# EAGLE design dice (EAGLE 9.6.2)
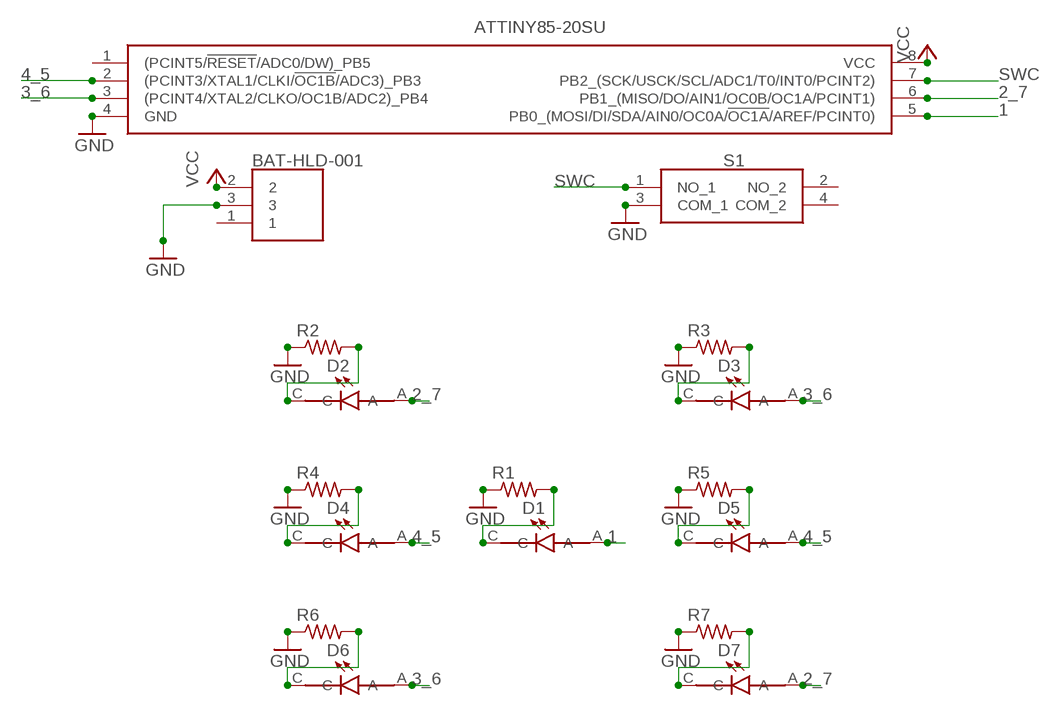
[diagram p0: schematic, sheet 1]

## Parts
D1  SML-LXT0805IW-TR  [LEDC2012X120N]
D2  SML-LXT0805IW-TR  [LEDC2012X120N]
D3  SML-LXT0805IW-TR  [LEDC2012X120N]
D4  SML-LXT0805IW-TR  [LEDC2012X120N]
D5  SML-LXT0805IW-TR  [LEDC2012X120N]
D6  SML-LXT0805IW-TR  [LEDC2012X120N]
D7  SML-LXT0805IW-TR  [LEDC2012X120N]
IC1  ATTINY85-20SU  [SOIC127P798X216-8N]
R1  R-US_R0805  [R0805]
R2  R-US_R0805  [R0805]
R3  R-US_R0805  [R0805]
R4  R-US_R0805  [R0805]
R5  R-US_R0805  [R0805]
R6  R-US_R0805  [R0805]
R7  R-US_R0805  [R0805]
S1  TS18-5-20-SL-160-SMT-TR  [TS18520SL160SMTTR]
U1  BAT-HLD-001  [BATHLD001]

## Nets
1: D1.A IC1.5(PB0_(MOSI/DI/SDA/AIN0/OC0A/!OC1A!/AREF/PCINT0))
2_7: D2.A D7.A IC1.6(PB1_(MISO/DO/AIN1/OC0B/OC1A/PCINT1))
3_6: D3.A D6.A IC1.3((PCINT4/XTAL2/CLKO/OC1B/ADC2)_PB4)
4_5: D4.A D5.A IC1.2((PCINT3/XTAL1/CLKI/!OC1B!/ADC3)_PB3)
GND: IC1.4(GND) R1.1 R2.1 R3.1 R4.1 R5.1 R6.1 R7.1 S1.3(COM_1) U1.3
N$1: D2.C R2.2
N$2: D4.C R4.2
N$3: D6.C R6.2
N$4: D1.C R1.2
N$5: D5.C R5.2
N$6: D3.C R3.2
N$7: D7.C R7.2
SWC: IC1.7(PB2_(SCK/USCK/SCL/ADC1/T0/INT0/PCINT2)) S1.1(NO_1)
VCC: IC1.8(VCC) U1.2
Unconnected: IC1.1((PCINT5/!RESET!/ADC0/DW)_PB5) S1.2(NO_2) S1.4(COM_2) U1.1

## Library data of the parts
D1-D7 = SML-LXT0805IW-TR:SML-LXT0805IW-TR: LED; Luminous Intensity:11µcd; Viewing Angle:140°; Forward Current:30mA; Forward Voltage:2V; Color:Red; LED Color:Red; Leaded Process Compatible:Yes; Lens Color:White; Mounting Type:Surface Mount ;RoHS Compliant: Yes Check availability <https://pricing.snapeda.com/parts/SML-LXT0805IW-TR/Lumex%20Opto/Components/view-part?ref=eda>; AVAILABILITY: In Stock; DESCRIPTION: Red - LED Indication - Discrete 2V 0805 (2012 Metric); MF: Lumex Opto/Components; MP: SML-LXT0805IW-TR; PACKAGE: 0805 Lumex; PRICE: None; PURCHASE-URL: https://pricing.snapeda.com/search/part/SML-LXT0805IW-TR/?ref=eda
IC1 = ATTINY85-20SU:ATTINY85-20SU: MICROCHIP - ATTINY85-20SU - MICROCONTROLLER MCU, 8 BIT, ATTINY, 20MHZ, SOIC-8 Source: Datasheet <https://componentsearchengine.com/Datasheets/2/ATTINY85-20SU.pdf>; DESCRIPTION: MICROCHIP - ATTINY85-20SU - MICROCONTROLLER MCU, 8 BIT, ATTINY, 20MHZ, SOIC-8; HEIGHT: 2.16mm; MANUFACTURER_NAME: Microchip; MANUFACTURER_PART_NUMBER: ATTINY85-20SU; MOUSER_PART_NUMBER: 556-ATTINY85-20SU; MOUSER_PRICE-STOCK: https://www.mouser.co.uk/ProductDetail/Microchip-Technology-Atmel/ATTINY85-20SU?qs=8jWQYweyg6N%2FGXnwAe4Icw%3D%3D
R1-R7 = adafruit:R-US_: RESISTOR, American symbol
S1 = TS18-5-20-SL-160-SMT-TR:TS18-5-20-SL-160-SMT-TR: Tactile Switches 5 x 5 mm, 2 mm Actuator Height, 160 gf, Silver, Surface Mount, TR, SPST, Tactile Switch Source: Datasheet <https://www.cuidevices.com/product/resource/ts18.pdf>; DESCRIPTION: Tactile Switches 5 x 5 mm, 2 mm Actuator Height, 160 gf, Silver, Surface Mount, TR, SPST, Tactile Switch; HEIGHT: 2.2mm; MANUFACTURER_NAME: CUI Devices; MANUFACTURER_PART_NUMBER: TS18-5-20-SL-160-SMT-TR; MOUSER_PART_NUMBER: 179-TS18520SL160SMTT; MOUSER_PRICE-STOCK: https://www.mouser.co.uk/ProductDetail/CUI-Devices/TS18-5-20-SL-160-SMT-TR?qs=tlsG%2FOw5FFjSVAS9XMKu7w%3D%3D
U1 = BAT-HLD-001:BAT-HLD-001: Coin Cell Battery Holders Linx CR2032 Battery Holder Source: Datasheet; DESCRIPTION: Coin Cell Battery Holders Linx CR2032 Battery Holder; HEIGHT: 4mm; MANUFACTURER_NAME: Linx Technologies; MANUFACTURER_PART_NUMBER: BAT-HLD-001; MOUSER_PART_NUMBER: 712-BAT-HLD-001; MOUSER_PRICE-STOCK: https://www.mouser.co.uk/ProductDetail/Linx-Technologies/BAT-HLD-001?qs=K5ta8V%252BWhta7hbVGfm4dqA%3D%3D

## Board
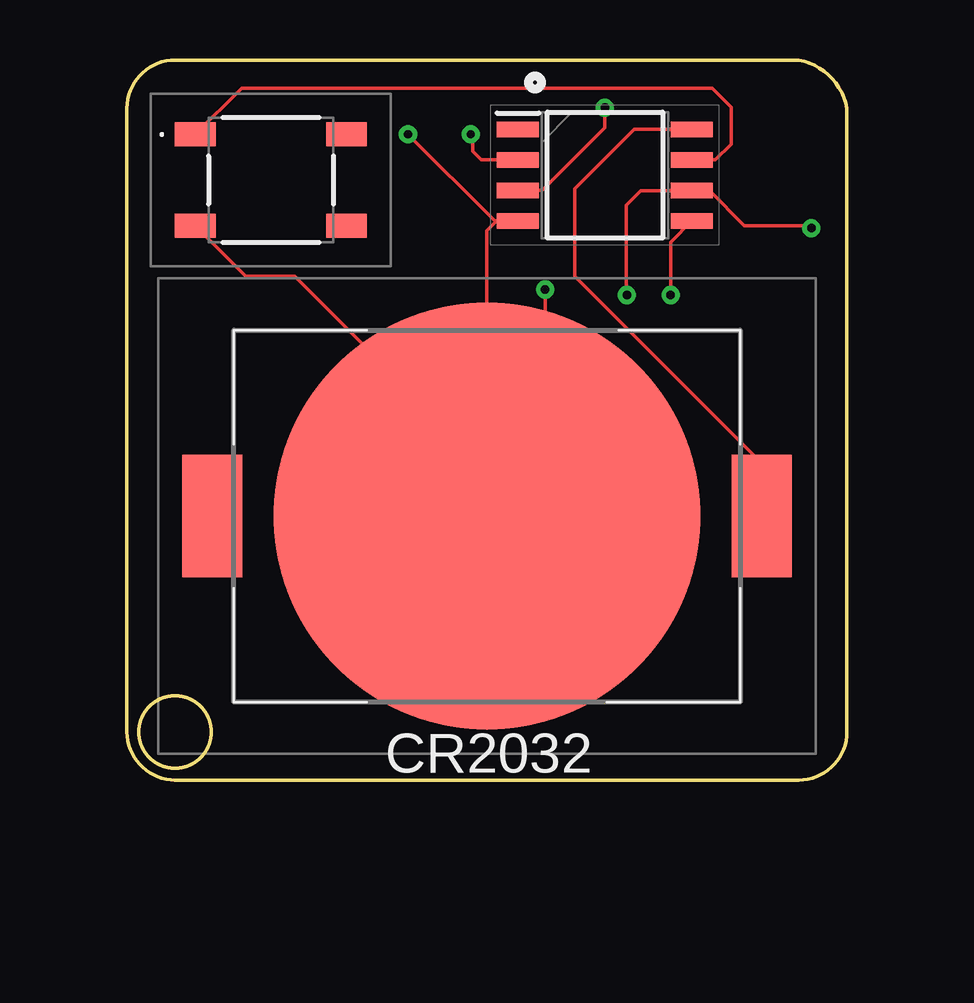
[diagram p1: board, top side]
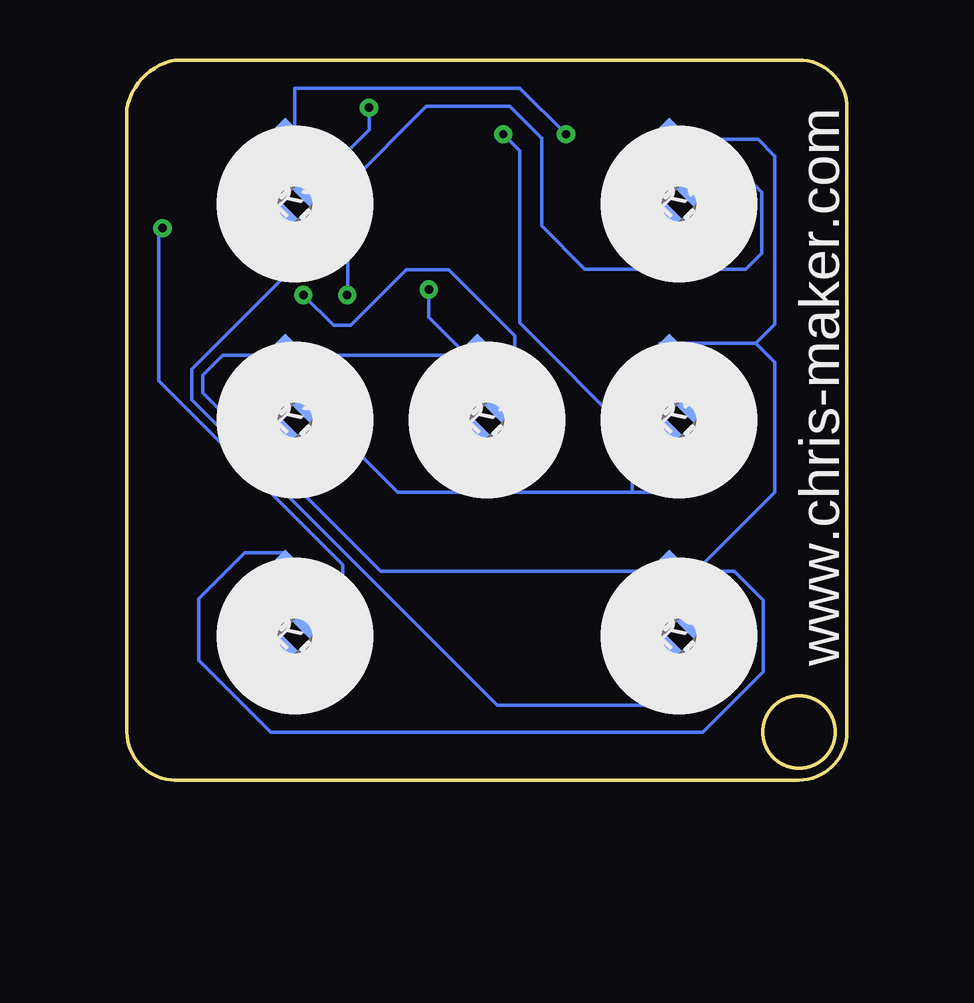
[diagram p2: board, bottom side, seen from below]

Size 30 x 30 mm. Coordinates in mm from the lower left corner, seen from the top.
Outline: 0,2 0,28 arc-90 2,30 28,30 arc-67 30,28 30,2 arc-90 28,0 2,0 arc-90 0,2
Outline: circle at 2,2 radius 1.5
Copper layers (1*16): Top 0.035mm / dielectric 1.5mm / Bottom 0.035mm
Design rules "default": minimum track width 6mil, minimum drill 0.35mm, track to track 6mil, track to pad 6mil, pad to pad 6mil, via to via 6mil, smd to smd 6mil, copper to edge 40mil, drill to drill 6mil, minimum pad ring 10mil, minimum via ring 8mil, stop-mask expansion 4mil, vias tented up to drill 0mil, thermal gap 10mil

### Footprints (pad centres in the part's own frame; a part is rotated, then mirrored left to right if it is on the bottom)
LEDC2012X120N = smd 1.1 x 1.45: A 0.9,0; C -0.9,0
SOIC127P798X216-8N = smd 1.75 x 0.65: 1 -3.625,1.905; 2 -3.625,0.635; 3 -3.625,-0.635; 4 -3.625,-1.905; 5 3.625,-1.905; 6 3.625,-0.635; 7 3.625,0.635; 8 3.625,1.905
R0805 = smd 1.1 x 1.4: 1 -1,0; 2 1,0
TS18520SL160SMTTR = smd 1.7 x 1: 1 -3.15,1.9; 2 3.15,1.9; 3 -3.15,-1.9; 4 3.15,-1.9
BATHLD001 = smd 2.5 x 5.1: 1 11.45,0; 2 -11.45,0 | smd 17.8 x 17.8: 3 0,0

### Placement (x,y rotation side)
D1  15,15 45 bottom
D2  7,24 45 bottom
D3  23,24 45 bottom
D4  7,15 45 bottom
D5  23,15 45 bottom
D6  7,6 45 bottom
D7  23,6 45 bottom
IC1  19.92,25.2 0 top
R1  16,17 225 bottom
R2  8,26 225 bottom
R3  24,26 225 bottom
R4  8,17 225 bottom
R5  24,17 225 bottom
R6  8,8 225 bottom
R7  24,8 225 bottom
S1  6,25 0 top
U1  15,11 180 top

### Tracks (layer width: path | path; a pad name or v marks a point on that pad's centre or on a via)
1  (via drill 0.35)
  Top 0.152: IC1.5 22.65,22.41 v22.65,20.21
  Bottom 0.152: D1.A 13.84,16.16 13.84,18.52 16.59,21.26 18.36,21.26 20.68,18.95 21.39,18.95 v22.65,20.21
2_7  (via drill 0.35)
  Top 0.152: v20.83,20.21 20.8,20.23 20.8,23.95 21.41,24.56 IC1.6 24.25,24.57 25.72,23.09 28.42,23.09 v28.52,22.99
  Bottom 0.152: D7.A 21.01,7.99 21.01,8.97 28.67,16.64 28.67,22.59 v28.52,22.99 | D2.A 5.87,24.64 5.28,25.22 4.29,25.22 3.56,24.49 3.56,21.95 4.22,21.29 10.92,21.29 12.72,23.09 12.72,26.75 14.05,28.07 17.53,28.07 20.8,24.79 20.8,20.68 v20.83,20.21
3_6  (via drill 0.35)
  Top 0.152: IC1.3 17.3,24.57 19.91,27.18 v19.91,28.02
  Bottom 0.152: D6.A 4.96,6.64 4.47,6.15 4.47,4.39 5.74,3.12 14.58,3.12 27.3,15.85 27.3,17.12 22.89,21.54 22.53,21.54 21.57,22.5 21.57,23.5 22.36,24.29 D3.A 19.91,27.09 v19.91,28.02
4_5  (via drill 0.35)
  Top 0.152: IC1.2 14.77,25.84 14.4,26.2 14.4,26.83 v14.32,26.91
  Bottom 0.152: D4.A 5,14.27 5,13 6,12 8.94,12 | D5.A 18.73,12 8.94,12 | v14.32,26.91 13.64,26.22 13.64,19.05 8.94,14.35 8.94,12
GND  (via drill 0.35)
  Top 0.152: 15,13 15,22.89 15.4,23.3 IC1.4 15.32,23.3 v11.71,26.91 | S1.3 4.95,21 7,21 15,13 | U1.3 15,13 | U1.3 15,13.51 | v17.42,20.43 17.42,13.42 U1.3
  Bottom 0.152: R4.1 7.79,18.21 3.79,18.21 | R2.1 3.71,26.71 3,26 3,19 3.79,18.21 | 6.29,8.71 R6.1 19.43,8.71 26.85,16.13 26.85,16.87 26.01,17.71 R5.1 R1.1 15.85,17.71 17.42,19.28 v17.42,20.43 | 6.29,8.71 3,12 3,17.41 3.79,18.21 | 6.29,8.71 4.7,8.71 3.48,7.49 3.48,4.52 6,2 24,2 27,5 27,7.55 25.09,9.47 23.47,9.47 23.29,9.29 R7.1 | R3.1 23,27 23,28.83 13.63,28.83 v11.71,26.91
N$1
  Bottom 0.152: R2.2 8.71,24.43 D2.C
N$2
  Bottom 0.152: R4.2 8.71,15.43 D4.C
N$3
  Bottom 0.152: R6.2 8.71,6.43 D6.C
N$4
  Bottom 0.152: R1.2 16.71,15.43 D1.C
N$5
  Bottom 0.152: R5.2 24.71,15.43 D5.C
N$6
  Bottom 0.152: R3.2 24.71,24.43 D3.C
N$7
  Bottom 0.152: R7.2 24.71,6.43 D7.C
SWC
  Top 0.152: S1.1 4.78,28.83 24.38,28.83 25.17,28.04 25.17,26.49 24.52,25.84 IC1.7
VCC
  Top 0.152: IC1.8 21.13,27.11 18.66,24.64 18.66,21 26.45,13.2 U1.2

### Text on the board
tNames: CR2032
bNames: www.chris-maker.com